# EAGLE design copy_before_rewire (EAGLE 7.7.0)
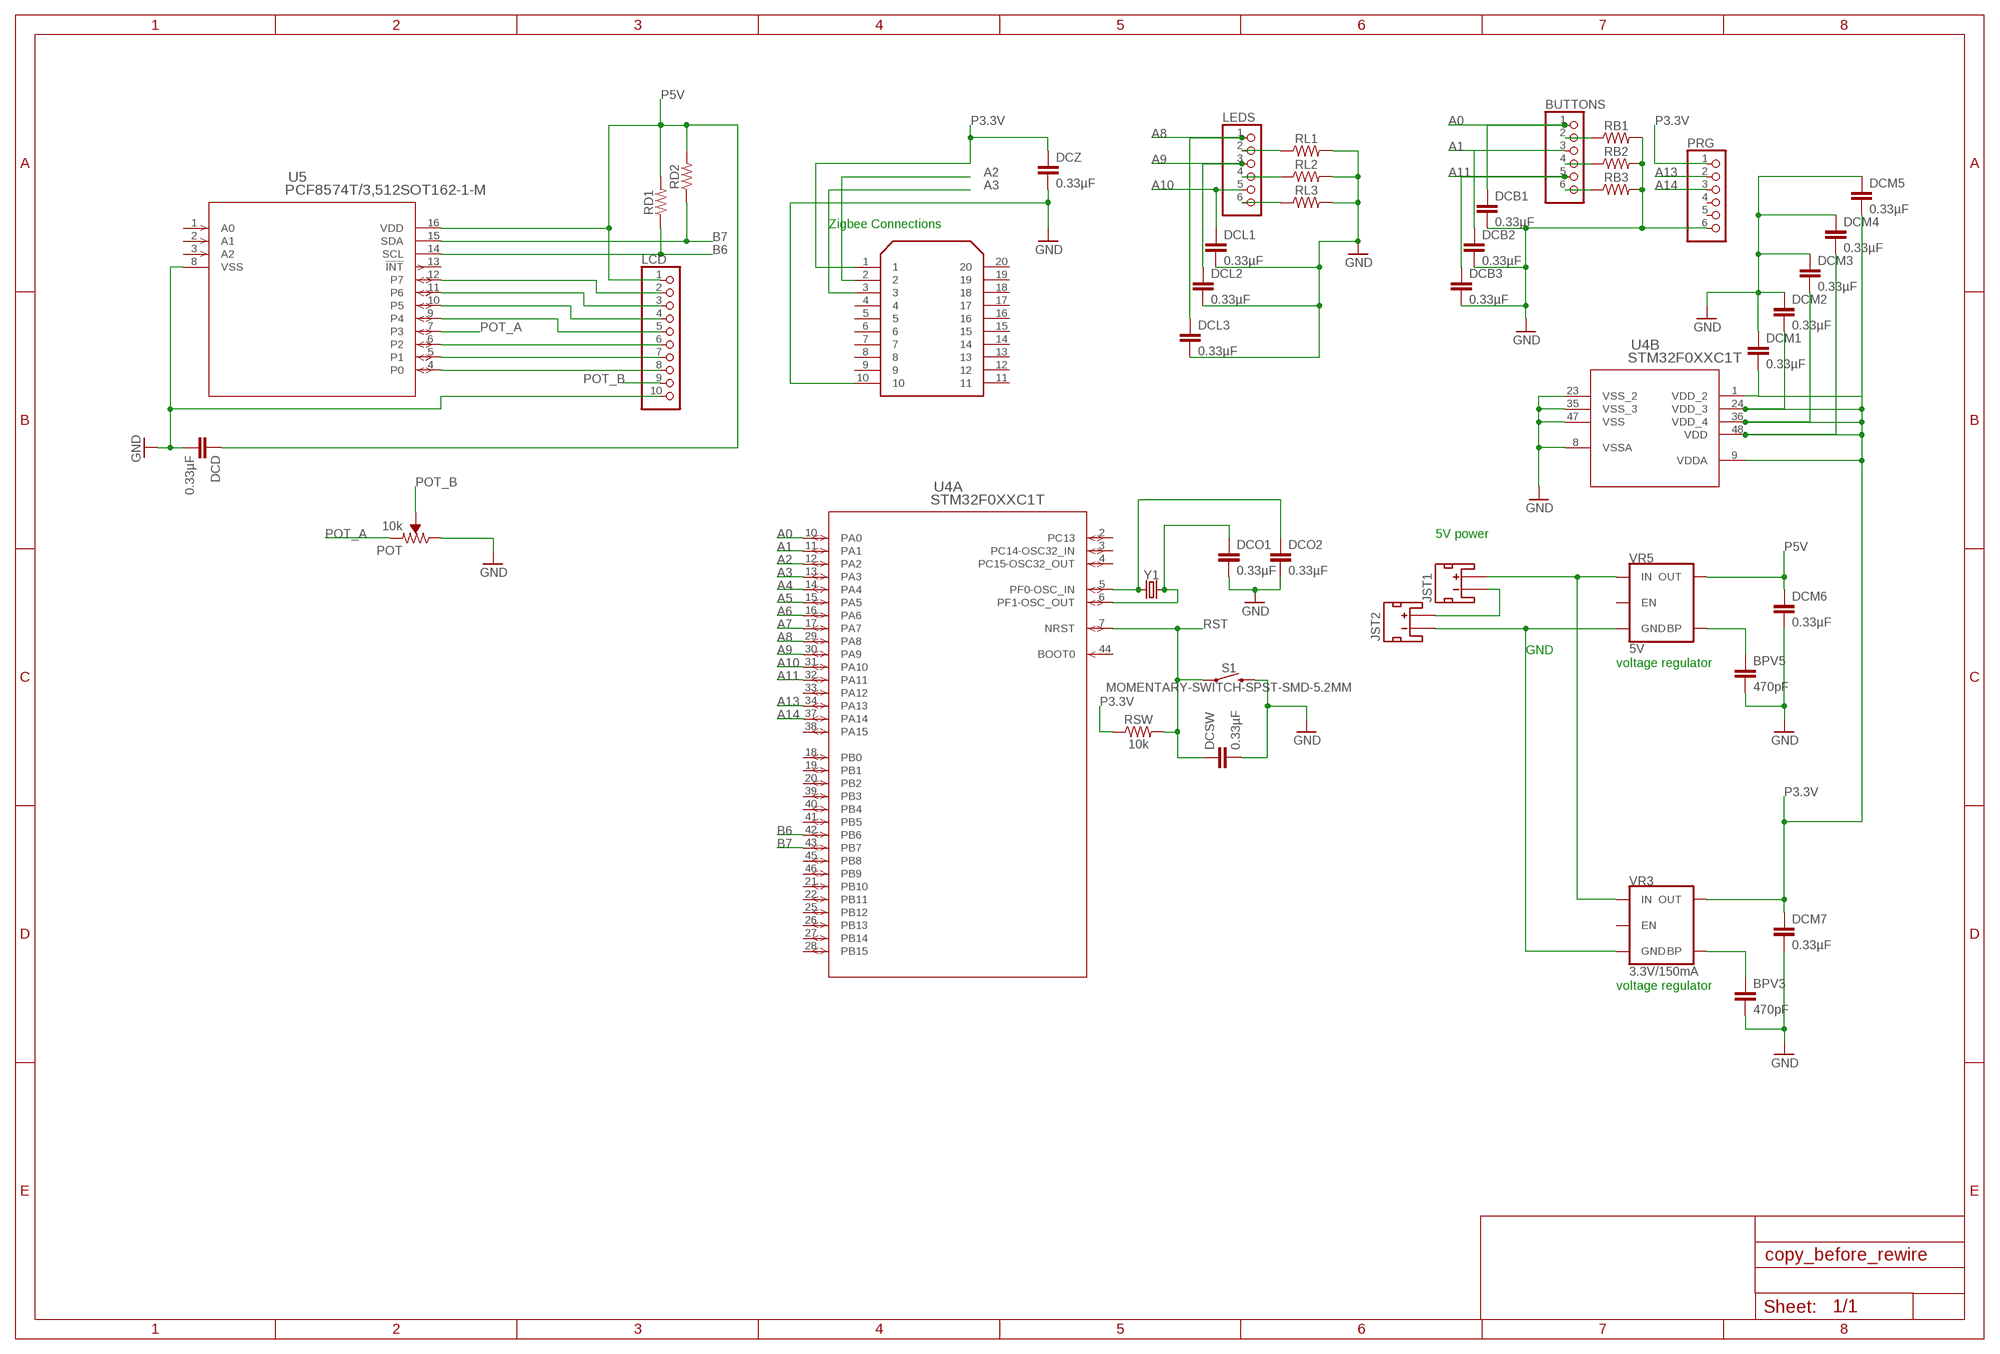
[diagram p0: schematic, sheet 1]

## Parts
BPV3  470pF  470PF-0603-50V-5%  [0603]
BPV5  470pF  470PF-0603-50V-5%  [0603]
BUTTONS  PINHD-1X6  [1X06]
DCB1  0.33µF  0.33UF/330NF-0805-50V-10%  [0805]
DCB2  0.33µF  0.33UF/330NF-0805-50V-10%  [0805]
DCB3  0.33µF  0.33UF/330NF-0805-50V-10%  [0805]
DCD  0.33µF  0.33UF/330NF-0805-50V-10%  [0805]
DCL1  0.33µF  0.33UF/330NF-0805-50V-10%  [0805]
DCL2  0.33µF  0.33UF/330NF-0805-50V-10%  [0805]
DCL3  0.33µF  0.33UF/330NF-0805-50V-10%  [0805]
DCM1  0.33µF  0.33UF/330NF-0805-50V-10%  [0805]
DCM2  0.33µF  0.33UF/330NF-0805-50V-10%  [0805]
DCM3  0.33µF  0.33UF/330NF-0805-50V-10%  [0805]
DCM4  0.33µF  0.33UF/330NF-0805-50V-10%  [0805]
DCM5  0.33µF  0.33UF/330NF-0805-50V-10%  [0805]
DCM6  0.33µF  0.33UF/330NF-0805-50V-10%  [0805]
DCM7  0.33µF  0.33UF/330NF-0805-50V-10%  [0805]
DCO1  0.33µF  0.33UF/330NF-0805-50V-10%  [0805]
DCO2  0.33µF  0.33UF/330NF-0805-50V-10%  [0805]
DCSW  0.33µF  0.33UF/330NF-0805-50V-10%  [0805]
DCZ  0.33µF  0.33UF/330NF-0805-50V-10%  [0805]
JST1  JST_2MM_MALE  [JST-2-SMD]
JST2  JST_2MM_MALE  [JST-2-SMD]
LCD  PINHD-1X10  [1X10]
LEDS  PINHD-1X6  [1X06]
POT  10k  TRIMPOT-PTH-10MM-KNOB-1/2W-10%  [TRIMPOT-PTH-3386U]
PRG  PINHD-1X6  [1X06]
RB1  RESISTOR0805  [0805]
RB2  RESISTOR0805  [0805]
RB3  RESISTOR0805  [0805]
RD1  RESISTOR0805  [0805]
RD2  RESISTOR0805  [0805]
RL1  RESISTOR0805  [0805]
RL2  RESISTOR0805  [0805]
RL3  RESISTOR0805  [0805]
RSW  10k  10KOHM-0603-1/10W-1%  [0603]
S1  MOMENTARY-SWITCH-SPST-SMD-5.2MM  [TACTILE_SWITCH_SMD_5.2MM]
U4  STM32F0XXC1T  [LQFP48-7X7MM]
U5  PCF8574T/3,512SOT162-1-M  [SOT162-1-M]
U$1  XB24-BPIT-004  [DIP-20]
VR3  3.3V/150mA  V_REG_MIC52053.3V  [SOT23-5]
VR5  5V  V_REG_MIC52055V  [SOT23-5]
Y1  CRYSTALPTH-HC49US  [HC49US]

## Nets
A0: BUTTONS.1 DCB1.1 U4.10(A:PA0)
A1: BUTTONS.3 U4.11(A:PA1)
A2: U4.12(A:PA2) U$1.2
A3: U4.13(A:PA3) U$1.3
A4: U4.14(A:PA4)
A5: U4.15(A:PA5)
A6: U4.16(A:PA6)
A7: U4.17(A:PA7)
A8: DCL3.1 LEDS.1 U4.29(A:PA8)
A9: DCL2.1 LEDS.3 U4.30(A:PA9)
A10: DCL1.1 LEDS.5 U4.31(A:PA10)
A11: BUTTONS.5 DCB3.1 U4.32(A:PA11)
A13: PRG.2 U4.34(A:PA13)
A14: PRG.3 U4.37(A:PA14)
B6: RD1.1 U4.42(A:PB6) U5.14(SCL)
B7: RD2.1 U4.43(A:PB7) U5.15(SDA)
GND: BPV3.2 BPV5.2 DCB1.2 DCB2.2 DCB3.2 DCD.2 DCL1.2 DCL2.2 DCL3.2 DCM1.1 DCM2.1 DCM3.1 DCM4.1 DCM5.1 DCM6.2 DCM7.2 DCO1.2 DCO2.2 DCSW.2 DCZ.2 LCD.10 POT.3(CW) PRG.6 RB1.2 RB2.2 RB3.2 RL1.2 RL2.2 RL3.2 S1.3 U4.8(B:VSSA) U4.23(B:VSS_2) U4.35(B:VSS_3) U4.47(B:VSS) U5.8(VSS) U$1.10
N$1: JST1.1(-) JST2.2(+)
N$2: BUTTONS.4 RB2.1
N$3: LEDS.6 RL3.1
N$4: LEDS.4 RL2.1
N$5: LEDS.2 RL1.1
N$6: BUTTONS.2 RB1.1
N$7: BUTTONS.6 RB3.1
N$8: DCB2.1
N$9: LCD.2 U5.12(P7)
N$10: LCD.3 U5.11(P6)
N$11: LCD.4 U5.10(P5)
N$12: LCD.5 U5.9(P4)
N$14: LCD.6 U5.6(P2)
N$15: LCD.7 U5.5(P1)
N$16: LCD.8 U5.4(P0)
N$21: DCO2.1 U4.5(A:PF0-OSC_IN) Y1.1
N$22: DCO1.1 U4.6(A:PF1-OSC_OUT) Y1.2
N$32: JST2.1(-) VR3.2(GND) VR5.2(GND)
N$34: BPV3.1 VR3.4(BP)
N$37: BPV5.1 VR5.4(BP)
N$38: JST1.2(+) VR3.1(IN) VR5.1(IN)
P3.3V: DCM1.2 DCM2.2 DCM3.2 DCM4.2 DCM5.2 DCM7.1 DCZ.1 PRG.1 RSW.1 U4.1(B:VDD_2) U4.9(B:VDDA) U4.24(B:VDD_3) U4.36(B:VDD_4) U4.48(B:VDD) U$1.1 VR3.5(OUT)
P5V: DCD.1 DCM6.1 LCD.1 RD1.2 RD2.2 U5.16(VDD) VR5.5(OUT)
POT_A: POT.1(CCW) U5.7(P3)
POT_B: LCD.9 POT.2(WIPER)
RST: DCSW.1 RSW.2 S1.1 U4.7(A:NRST)
Unconnected: JST1.NC1(PAD1) JST1.NC2(PAD2) JST2.NC1(PAD1) JST2.NC2(PAD2) PRG.4 PRG.5 U4.2(A:PC13) U4.3(A:PC14-OSC32_IN) U4.4(A:PC15-OSC32_OUT) U4.18(A:PB0) U4.19(A:PB1) U4.20(A:PB2) U4.21(A:PB10) U4.22(A:PB11) U4.25(A:PB12) U4.26(A:PB13) U4.27(A:PB14) U4.28(A:PB15) U4.33(A:PA12) U4.38(A:PA15) U4.39(A:PB3) U4.40(A:PB4) U4.41(A:PB5) U4.44(A:BOOT0) U4.45(A:PB8) U4.46(A:PB9) U5.1(A0) U5.2(A1) U5.3(A2) U5.13(!INT) U$1.4 U$1.5 U$1.6 U$1.7 U$1.8 U$1.9 U$1.11 U$1.12 U$1.13 U$1.14 U$1.15 U$1.16 U$1.17 U$1.18 U$1.19 U$1.20 VR3.3(EN) VR5.3(EN)

## Notes on the sheet
- Zigbee Connections
- 5V power
- GND
- voltage regulator
- voltage regulator

## Library data of the parts
BPV3 BPV5 = SparkFun-Capacitors:470PF: 470pF ceramic capacitors A capacitor is a passive two-terminal electrical component used to store electrical energy temporarily in an electric field.; PROD_ID: CAP-07884
BUTTONS LEDS PRG = pinhead:PINHD-1X6: PIN HEADER
DCB1-DCB3 DCD DCL1-DCL3 DCM1-DCM7 DCO1 DCO2 DCSW DCZ = SparkFun-Capacitors:0.33UF/330NF: 0.33µF/330nF ceramic capacitors A capacitor is a passive two-terminal electrical component used to store electrical energy temporarily in an electric field.; PROD_ID: CAP-08469
JST1 JST2 = SparkFun-Connectors:JST_2MM_MALE: JST 2MM MALE RA CONNECTOR Two pin, compact surface mount connector. Commonly used as a battery input connection point. We really like the solid locking feeling and high current rating on these small connectors. We use these all the time as battery connectors. Mates to single-cell LiPo batteries. Here is the connector we sell at SparkFun: JST Right Angle Connector - White <https://www.sparkfun.com/products/8612> (PRT-08612) Datasheet <http://www.sparkfun.com/datasheets/Prototyping/Connectors/JST-Horizontal.pdf> It was used on these SparkFun products: SparkFun MOSFET Power Controller <https://www.sparkfun.com/products/11214> (PRT-11214) SparkFun Battery Babysitter - LiPo Battery Manager <https://www.sparkfun.com/products/13777> (PRT-13777) And many, many others that required a lipo battery connection.; PROD_ID: CONN-11443; SF_ID: PRT-08612
LCD = pinhead:PINHD-1X10: PIN HEADER
POT = SparkFun-Resistors:TRIMPOT: Trimming Potentiometer (Trimpot) Three-terminal potentiometers, with an adjustable wiper and two adjustable resistors. A pot can be used to create a configurable voltage divider, or as a variable resistor. "Trimpots" are a subset of potentiometers, usually intended for "set-and-forget" applications. They're often more delicate than standard potentiometers - rated for fewer turns. Variants PTH-KNOB - PTH Trimpot w/ finger-adjustable knob Trimpot 10K with Knob <https://www.sparkfun.com/products/9806> (COM-09806) Datasheet <http://www.sparkfun.com/datasheets/Components/General/TSR-3386.pdf> SMD-3MM-CLOSED-FRAME - SMD 3mm Square Closed-Frame Trimpot Used on e.g. EasyDriver - Stepper Motor Driver <https://www.sparkfun.com/products/12779> Datasheet <http://www.bitechnologies.com/pdfs/22.pdf> (22AR10KTR) SMD-5MM - SMD 5mm Square Closed-Frame Trimpot Used on e.g. IOIO-OTG - V2.2 <https://www.sparkfun.com/products/13613> Datasheet <http://www.vishay.com/docs/51008/ts53.pdf> (TS53YL502MR10) SMD-3MM-1/10W-25% - 3mm Square Open-Frame Trimpot Used on e.g. SparkFun Shapeoko <https://www.sparkfun.com/products/13899> Datasheet <http://www.bourns.com/docs/Product-Datasheets/TC33.pdf> (TC33X-2-103E); PROD_ID: RES-09730; SF_SKU: COM-09806
RB1-RB3 RD1 RD2 RL1-RL3 = SparkFun-Resistors:RESISTOR: Generic Resistor Package
RSW = SparkFun-Resistors:10KOHM: 10kΩ resistor A resistor is a passive two-terminal electrical component that implements electrical resistance as a circuit element. Resistors act to reduce current flow, and, at the same time, act to lower voltage levels within circuits. - Wikipedia; PROD_ID: RES-00824
S1 = SparkFun-Switches:MOMENTARY-SWITCH-SPST: Momentary Switch (Pushbutton) - SPST Normally-open (NO) SPST momentary switches (buttons, pushbuttons). Variants PTH-12MM - 12mm square, through-hole Momentary Pushbutton Switch - 12mm Square <https://www.sparkfun.com/products/9190> (COM-09190) PTH-6.0MM, PTH-6.0MM-KIT - 6.0mm square, through-hole Mini Pushbutton Switch <https://www.sparkfun.com/products/97> (COM-00097) KIT package intended for soldering kit's - only one side of pads' copper is exposed. PTH-RIGHT-ANGLE-KIT - Right-angle, through-hole Right Angle Tactile Button <https://www.sparkfun.com/products/10791> - Used on SparkFun BigTime Watch Kit <https://www.sparkfun.com/products/11734> SMD-12MM - 12mm square, surface-mount Tactile Button - SMD (12mm) <https://www.sparkfun.com/products/12993> (COM-12993) Used on SparkFun PicoBoard <https://www.sparkfun.com/products/11888> SMD-4.5MM - 4.5mm Square Trackball Switch Used on SparkFun Blackberry Trackballer Breakout <https://www.sparkfun.com/products/13169> SMD-4.6MMX2.8MM - 4.60mm x 2.80mm, surface mount Used on SparkFun SAMD21 Mini Breakout <https://www.sparkfun.com/products/13664> SMD-5.2MM, SMD-5.2-REDUNDANT - 5.2mm square, surface-mount Mini Pushbutton Switch - SMD <https://www.sparkfun.com/products/8720> (COM-08720) Used on Arduino Pro Mini <https://www.sparkfun.com/products/11114> REDUNDANT package connects both switch circuits together SMD-6.0X3.5MM - 6.0 x 3.5mm, surface mount Momentary Reset Switch SMD <https://www.sparkfun.com/products/8229> (COM-08229) SMD-6.2MM-TALL - 6.2mm square, surface mount Tactile Button - SMD (6mm) <https://www.sparkfun.com/products/12992> Used on SparkFun Digital Sandbox <https://www.sparkfun.com/products/12651> SMD-RIGHT-ANGLE - Right-angle, surface mount Used on SparkFun Block for Intel® Edison - Arduino <https://www.sparkfun.com/products/13036>; PROD_ID: SWCH-08247; SF_SKU: COM-08720
U4 = ECE477_Resources:STM32F0XXC1T; MANUFACTURER_PART_NUMBER: stm32f0xxc1t; VENDOR: STMicroelectronics
U5 = ECE477_Resources:PCF8574T/3,512; MANUFACTURER_PART_NUMBER: PCF8574T3512; VENDOR: NXP
U$1 = XB24-BPIT-004:XB24-BPIT-004: Xbee Zb (Zigbee Pro Feature Set), 1mw, Wire Antenna, 250000; AVAILABILITY: Unavailable; DESCRIPTION: Xbee Znet 2.5 _Series 2_, 1mw, Pcb Antenna, 250000 Bps, Rout; MF: Digi International; MP: XB24-BPIT-004; PACKAGE: Module Digi International; PRICE: None
VR3 = SparkFun-IC-Power:V_REG_MIC5205: V_REG MIC5205 Standard 3.3V, 5V, and Adjustable 150mA LDO voltage regulator in SOT-23 layout. Micrel part MIC5205. BP (by-pass) pin is used to lower output noise with 470pF cap, may be left open. On the adjustable version BP is used to set output.; PROD_ID: VREG-00822
VR5 = SparkFun-IC-Power:V_REG_MIC5205: V_REG MIC5205 Standard 3.3V, 5V, and Adjustable 150mA LDO voltage regulator in SOT-23 layout. Micrel part MIC5205. BP (by-pass) pin is used to lower output noise with 470pF cap, may be left open. On the adjustable version BP is used to set output.; PROD_ID: VREG-00823
Y1 = SparkFun-Clocks:CRYSTAL: Crystals (Generic) These are passive quartz crystals, which can be used as a clock source for a microcontroller. Crystal's are two-terminal devices. They require external "load" capacitors to generate an oscillating signal.

## Board
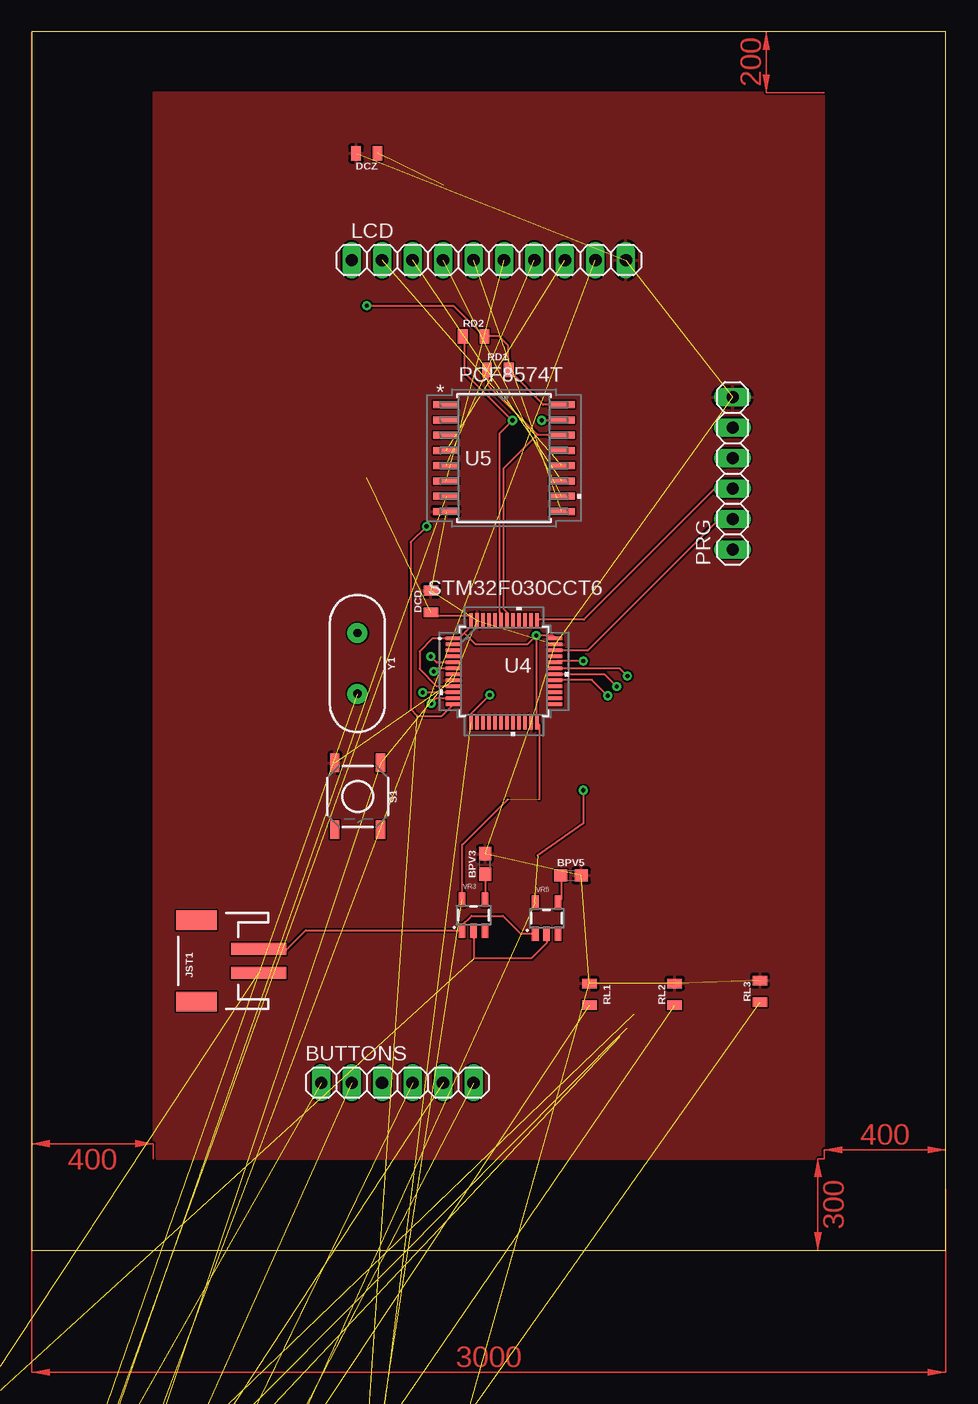
[diagram p1: board, top side]
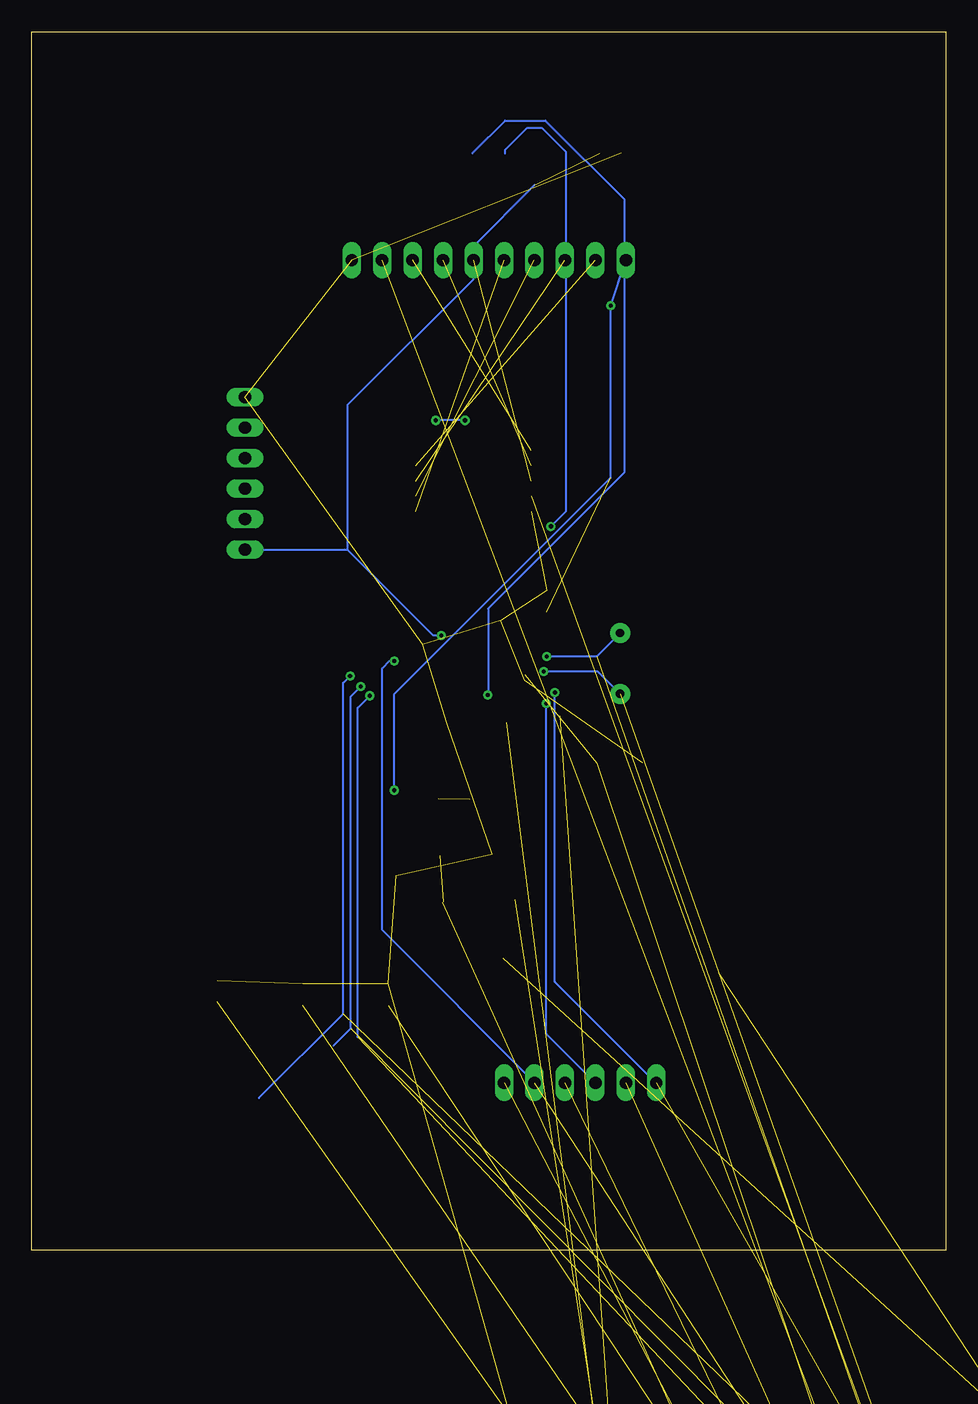
[diagram p2: board, bottom side, seen from below]

Size 76.2 x 101.6 mm. Coordinates in mm from the lower left corner, seen from the top.
Outline: 0,0 76.2,0 76.18,101.6 0,101.6 0,0
Copper layers (1*16): Top 0.035mm / dielectric 1.5mm / Bottom 0.035mm
Design rules "default": minimum track width 6mil, minimum drill 0.35mm, track to track 6mil, track to pad 6mil, pad to pad 6mil, via to via 6mil, smd to smd 6mil, copper to edge 40mil, drill to drill 6mil, minimum pad ring 10mil, minimum via ring 8mil, stop-mask expansion 4mil, vias tented up to drill 0mil, thermal gap 10mil

### Footprints (pad centres in the part's own frame; a part is rotated, then mirrored left to right if it is on the bottom)
0603 = smd 1.1 x 1: 1 -0.85,0; 2 0.85,0
1X06 = drill 1.016 long: 1 -6.35,0; 2 -3.81,0; 3 -1.27,0; 4 1.27,0; 5 3.81,0; 6 6.35,0
0805 = smd 0.8 x 1.2: 1 -0.9,0; 2 0.9,0
JST-2-SMD = smd 1 x 4.6: 1 -1,-3.7; 2 1,-3.7 | smd 1.6 x 3.4: NC1 -3.4,1.5; NC2 3.4,1.5
1X10 = drill 1.016 long: 1 -11.43,0; 2 -8.89,0; 3 -6.35,0; 4 -3.81,0; 5 -1.27,0; 6 1.27,0; 7 3.81,0; 8 6.35,0; 9 8.89,0; 10 11.43,0
TRIMPOT-PTH-3386U = drill 1.016 pad 1.88 square: 1 -2.54,-0.015 | drill 1.016 pad 1.88: 2 0,-0.015; 3 2.54,-0.015
TACTILE_SWITCH_SMD_5.2MM = smd 1.524 x 0.762: 1 -2.794,1.905; 2 2.794,1.905; 3 -2.794,-1.905; 4 2.794,-1.905
LQFP48-7X7MM = smd 1.194 x 0.305: 1 -4.25,2.75; 2 -4.25,2.25; 3 -4.25,1.75; 4 -4.25,1.25; 5 -4.25,0.75; 6 -4.25,0.25; 7 -4.25,-0.25; 8 -4.25,-0.75; 9 -4.25,-1.25; 10 -4.25,-1.75; 11 -4.25,-2.25; 12 -4.25,-2.75; 25 4.25,-2.75; 26 4.25,-2.25; 27 4.25,-1.75; 28 4.25,-1.25; 29 4.25,-0.75; 30 4.25,-0.25; 31 4.25,0.25; 32 4.25,0.75; 33 4.25,1.25; 34 4.25,1.75; 35 4.25,2.25; 36 4.25,2.75 | smd 0.305 x 1.194: 13 -2.75,-4.25; 14 -2.25,-4.25; 15 -1.75,-4.25; 16 -1.25,-4.25; 17 -0.75,-4.25; 18 -0.25,-4.25; 19 0.25,-4.25; 20 0.75,-4.25; 21 1.25,-4.25; 22 1.75,-4.25; 23 2.25,-4.25; 24 2.75,-4.25; 37 2.75,4.25; 38 2.25,4.25; 39 1.75,4.25; 40 1.25,4.25; 41 0.75,4.25; 42 0.25,4.25; 43 -0.25,4.25; 44 -0.75,4.25; 45 -1.25,4.25; 46 -1.75,4.25; 47 -2.25,4.25; 48 -2.75,4.25
SOT162-1-M = smd 2.108 x 0.584: 1 -4.826,4.445; 2 -4.826,3.175; 3 -4.826,1.905; 4 -4.826,0.635; 5 -4.826,-0.635; 6 -4.826,-1.905; 7 -4.826,-3.175; 8 -4.826,-4.445; 9 4.826,-4.445; 10 4.826,-3.175; 11 4.826,-1.905; 12 4.826,-0.635; 13 4.826,0.635; 14 4.826,1.905; 15 4.826,3.175; 16 4.826,4.445
DIP-20 = drill 0.5 square: 1 1.254,26.009 | drill 0.5 octagon: 2 1.254,24.009; 3 1.254,22.009; 4 1.254,20.009; 5 1.254,18.009; 6 1.254,16.009; 7 1.254,14.009; 8 1.254,12.009; 9 1.254,10.009; 10 1.254,8.009; 11 23.254,8.009; 12 23.254,10.009; 13 23.254,12.009; 14 23.254,14.009; 15 23.254,16.009; 16 23.254,18.009; 17 23.254,20.009; 18 23.254,22.009; 19 23.254,24.009; 20 23.254,26.009
SOT23-5 = smd 0.55 x 1.2: 1 -0.95,-1.3; 2 0,-1.3; 3 0.95,-1.3; 4 0.95,1.3; 5 -0.95,1.3
HC49US = drill 0.7 pad 1.651: 1 -2.54,0; 2 2.54,0

### Placement (x,y rotation side)
BPV3  37.8,32.21 90 top
BPV5  44.96,31.24 0 top
BUTTONS  30.48,13.97 0 top
DCB1  -12.45,-52.07 0 top  (outside the outline)
DCB2  -12.45,-55.63 0 top  (outside the outline)
DCB3  -12.45,-59.18 0 top  (outside the outline)
DCD  33.27,54.1 90 top
DCL1  -12.45,-41.4 0 top  (outside the outline)
DCL2  -12.45,-44.96 0 top  (outside the outline)
DCL3  -12.45,-48.51 0 top  (outside the outline)
DCM1  -12.45,-23.62 0 top  (outside the outline)
DCM2  -12.45,-27.18 0 top  (outside the outline)
DCM3  -12.45,-30.73 0 top  (outside the outline)
DCM4  -12.45,-34.29 0 top  (outside the outline)
DCM5  -12.45,-37.85 0 top  (outside the outline)
DCM6  -12.45,-93.22 0 top  (outside the outline)
DCM7  -12.45,-96.77 0 top  (outside the outline)
DCO1  -12.45,-68.33 0 top  (outside the outline)
DCO2  -12.45,-71.88 0 top  (outside the outline)
DCSW  -12.45,-86.11 0 top  (outside the outline)
DCZ  27.94,91.44 180 top
JST1  15.24,24.13 90 top
JST2  -9.91,-15.49 0 top  (outside the outline)
LCD  38.1,82.55 0 top
LEDS  -6.1,-64.77 0 top  (outside the outline)
POT  -19.3,-92.96 0 top  (outside the outline)
PRG  58.42,64.77 90 top
RB1  -12.45,-75.44 0 top  (outside the outline)
RB2  -12.45,-78.99 0 top  (outside the outline)
RB3  -12.45,-82.55 0 top  (outside the outline)
RD1  38.86,73.41 0 top
RD2  36.83,76.2 0 top
RL1  46.48,21.34 90 top
RL2  53.59,21.34 90 top
RL3  60.71,21.59 90 top
RSW  -12.45,-89.66 0 top  (outside the outline)
S1  27.18,37.85 270 top
U4  39.37,48.26 0 top
U5  39.37,66.04 0 top
U$1  25.65,-55.12 0 top  (outside the outline)
VR3  36.83,27.94 0 top
VR5  42.93,27.69 0 top
Y1  27.15,48.92 270 top

### Tracks (layer width: path | path; a pad name or v marks a point on that pad's centre or on a via)
A0  (via drill 0.35)  (1 unrouted)
  Top 0.152: v32.59,46.51 32.61,46.48 35.05,46.48 U4.10
  Bottom 0.152: v32.59,46.51 32.59,22.38 24.23,14.02 BUTTONS.1
A1  (via drill 0.35)
  Top 0.152: v33.3,45.59 33.73,46.02 35.05,46.02 U4.11
  Bottom 0.152: v33.3,45.59 33.3,18.06 BUTTONS.3
A2  (via drill 0.35)  (1 unrouted)
  Top 0.152: v32.92,60.35 31.6,59.03 31.6,45.11 32.16,44.55 34.19,44.55 35.05,45.41 U4.12
  Bottom 0.152: v32.92,60.35 31.7,61.57 31.7,91.59 33.68,93.57 34.9,93.57 36.73,91.75 36.73,91.44
A3  (via drill 0.35)  (1 unrouted)
  Top 0.152: v38.18,46.3 36.62,44.75 U4.13
  Bottom 0.152: v38.18,46.3 38.15,46.33 38.15,53.49 26.82,64.82 26.82,87.63 33.38,94.18 36.73,94.18 39.47,91.44
A8  (via drill 0.35)  (2 unrouted)
  Top 0.152: U4.29 43.74,47.55 46.69,47.55 v48.01,46.23
  Bottom 0.152: 49.02,17.78 49.02,42.67 49.02,45.21 v48.01,46.23
A9  (via drill 0.35)  (2 unrouted)
  Top 0.152: U4.30 43.74,48.01 47.75,48.01 v48.77,46.99
  Bottom 0.152: 51.05,17.04 49.58,18.52 49.58,46.18 v48.77,46.99
A10  (via drill 0.35)  (2 unrouted)
  Top 0.152: 43.59,48.46 U4.31 49.03,48.51 v49.66,47.88
  Bottom 0.152: 57.25,12.7 50.24,19.71 50.24,47.3 v49.66,47.88
A11  (via drill 0.35)  (1 unrouted)
  Top 0.152: 43.74,49.07 43.68,49.04 | 43.68,49.04 U4.32 | v45.97,49.12 43.75,49.12 43.68,49.04
  Bottom 0.152: BUTTONS.5 34.29,14.02 46.99,26.72 46.99,48.51 46.39,49.12 v45.97,49.12
A13
  Top 0.152: PRG.2 57.3,60.96 46.33,49.99 43.74,49.99 U4.34
A14
  Top 0.152: U4.37 42.22,52.58 46.02,52.58 56.84,63.4 58.37,63.4 PRG.3
B6
  Top 0.152: 42.15,68 42.18,67.97 44.2,67.97 U5.14 | 42.15,68 38.01,72.14 RD1.1 | 42.15,68 39.32,65.18 39.32,53.49 39.62,53.19 39.62,52.58 U4.42
B7  (via drill 0.35)
  Top 0.152: U4.43 39.17,52.58 39.17,53.03 39.01,53.19 39.01,68.12 v40.08,69.19 40.03,69.19 36.07,73.15 36.07,76.11 RD2.1 | v42.52,69.19 44.2,69.19 U5.15
  Bottom 0.152: v40.08,69.19 v42.52,69.19
GND  (35 unrouted)
  pour Top: 10.16,7.62 66.04,7.62 66.04,96.52 10.16,96.52
N$1  (1 unrouted)
N$2  (1 unrouted)
N$3  (1 unrouted)
N$4  (1 unrouted)
N$5  (1 unrouted)
N$6  (1 unrouted)
N$7  (1 unrouted)
N$9  (1 unrouted)
N$10  (1 unrouted)
N$11  (1 unrouted)
N$12  (1 unrouted)
N$14  (1 unrouted)
N$15  (1 unrouted)
N$16  (1 unrouted)
N$21  (via drill 0.35)  (1 unrouted)
  Top 0.152: U4.5 35.11,49 33.78,49 v33.27,49.51
  Bottom 0.152: v33.27,49.51 29.11,49.51 Y1.1
N$22  (via drill 0.35)  (1 unrouted)
  Top 0.152: U4.6 33.78,48.51 v33.53,48.26
  Bottom 0.152: v33.53,48.26 29.03,48.26 Y1.2
N$32  (1 unrouted)
  Top 0.152: VR5.2 42.93,25.62 41.66,24.35 36.88,24.35 36.88,26.52 VR3.2
N$34
  Top 0.152: BPV3.1 37.8,29.26 VR3.4
N$37
  Top 0.152: BPV5.1 44.13,31.22 44.13,29.24 VR5.4
N$38
  Top 0.152: 35.81,26.67 22.86,26.67 21.18,24.99 19.05,24.99 JST1.2 | 35.81,26.67 35.81,27.03 36.68,27.89 39.27,27.89 40.74,26.42 41.96,26.42 VR5.1 | 35.81,26.67 VR3.1
P3.3V  (via drill 0.35)  (10 unrouted)
  Top 0.152: U4.9 33.78,47.02 32.33,48.46 32.33,49.94 33.4,51 U4.1 35.62,51.01 36.07,51.46 | 36.58,52.88 33.27,52.88 | 36.58,52.88 36.73,52.73 36.73,52.58 U4.48 36.58,52.88 | 36.07,51.46 36.58,51.97 36.58,52.88 | 39.67,37.59 35.88,33.8 VR3.5 | v42.06,51.26 42.06,44.04 U4.24 42.32,43.81 42.32,37.61 | v42.06,51.26 43.43,51.26 U4.36 | 36.07,51.46 37.01,50.52 41.3,50.52 42.04,51.26 v42.06,51.26
  Bottom 0.152: 49.84,58.37 58.37,58.37 PRG.1 | 49.84,58.37 42.72,51.26 v42.06,51.26 | 34.29,88.8 39.37,83.72 39.37,80.97 49.84,70.51 49.84,58.37
P5V  (via drill 0.35)  (3 unrouted)
  Top 0.152: VR5.5 41.91,29.05 | U5.16 42.63,70.48 RD1.2 39.71,75.44 38.95,76.2 RD2.2 35.14,78.74 v27.94,78.74 | 42.16,32.93 45.97,35.56 v45.97,38.35
  Bottom 0.152: v45.97,38.35 45.97,46.38 27.94,64.41 v27.94,78.74 LCD.1
POT_A  (1 unrouted)
POT_B  (1 unrouted)
RST  (3 unrouted)
(copper drawn outside any net)
  shapes: Top area x6